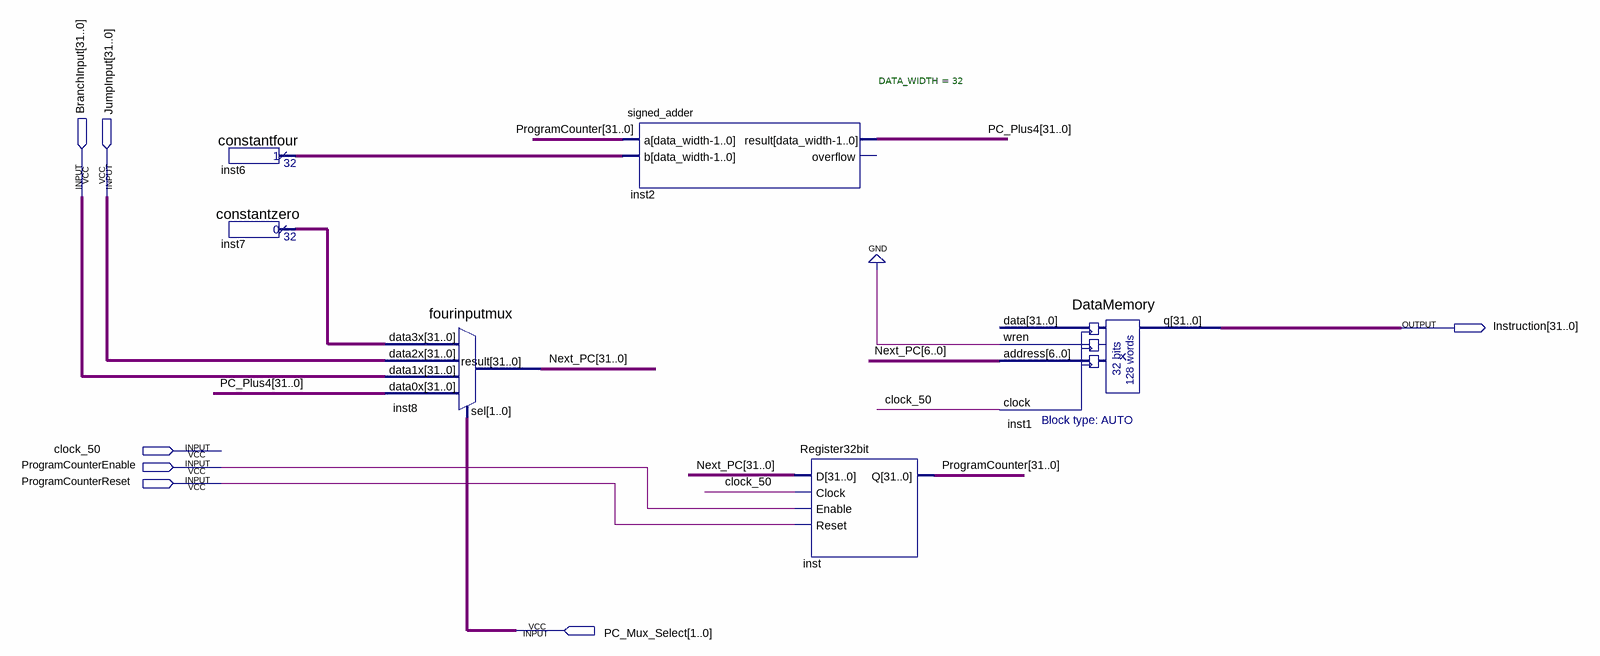
[diagram p0: schematic sheet]
// Quartus schematic InstructionFetch_Stage.bdf as structural Verilog: 6 symbols, 7 pins
module InstructionFetch_Stage (
  input  [31:0] BranchInput,
  input  [31:0] JumpInput,
  input  clock_50,
  input  ProgramCounterEnable,
  input  ProgramCounterReset,
  input  [1:0] PC_Mux_Select,
  output [31:0] Instruction
);

  wire [31:0] inst6_result, inst7_result, Next_PC, PC_Plus4, ProgramCounter;

  constantfour inst6 (.result(inst6_result));
  constantzero inst7 (.result(inst7_result));
  fourinputmux inst8 (
    .data3x(inst7_result), .data2x(JumpInput), .data1x(BranchInput), .data0x(PC_Plus4), .sel(PC_Mux_Select),
    .result(Next_PC));
  signed_adder #(.DATA_WIDTH(32)) inst2 (.a(ProgramCounter), .b(inst6_result), .result(PC_Plus4));  // open: overflow
  Register32bit inst (
    .D(Next_PC), .Clock(clock_50), .Enable(ProgramCounterEnable), .Reset(ProgramCounterReset),
    .Q(ProgramCounter));
  DataMemory inst1 (.wren(1'b0), .address(Next_PC[6:0]), .clock(clock_50), .q(Instruction));  // open: data
endmodule
